# Altium schematic sheet Cameras.SchDoc
size Letter
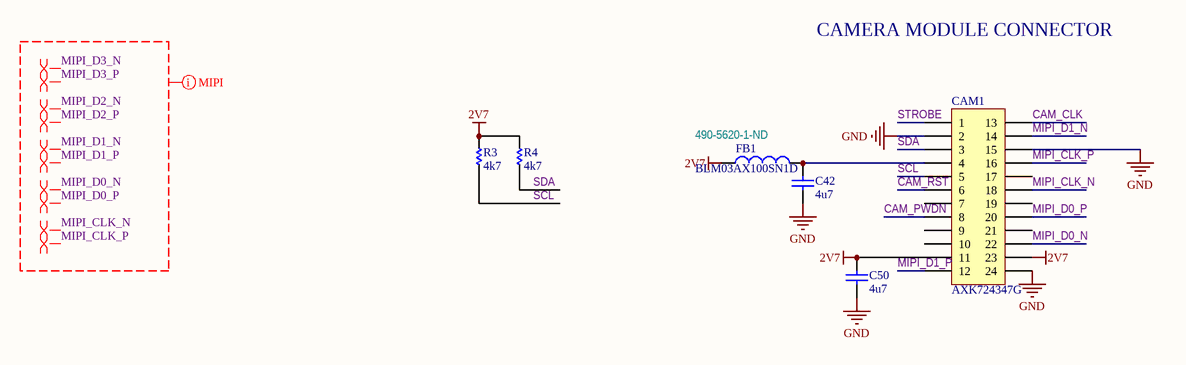
[diagram p0: Cameras.SchDoc]

## Parts
C42  4u7  [CAPC1005N]
C50  4u7  [CAPC1005N]
CAM1  AXK724347G  [LI-OV5640-MIPI-AF]
FB1  BLM03AX100SN1D  Supplier Part Number 1: 490-5620-1-ND  [1608[0603]]
R3  4k7  [RESC0603N]
R4  4k7  [RESC0603N]

## Nets
2V7: C50.2 CAM1.11 CAM1.23 FB1.1 R3.2 R4.2
GND: C42.1 C50.1 CAM1.2 CAM1.15 CAM1.24
CAM_CLK: CAM1.13
CAM_PWDN: CAM1.8
CAM_RST: CAM1.6
MIPI_CLK_N: CAM1.18
MIPI_CLK_P: CAM1.16
MIPI_D0_N: CAM1.22
MIPI_D0_P: CAM1.20
MIPI_D1_N: CAM1.14
MIPI_D1_P: CAM1.12
SCL: CAM1.5 R3.1
SDA: CAM1.3 R4.1
STROBE: CAM1.1
NetC42_2: C42.2 CAM1.4 FB1.2

Not connected (* = marked no-connect by the designer): CAM1 7 9 10 17 19 21

## Layout directives
net class MIPI2: MIPI_CLK_N, MIPI_CLK_P, MIPI_D0_N, MIPI_D0_P, MIPI_D1_N, MIPI_D1_P, MIPI_D2_N, MIPI_D2_P, MIPI_D3_N, MIPI_D3_P
differential pair: MIPI_CLK_N, MIPI_CLK_P, MIPI_D0_N, MIPI_D0_P, MIPI_D1_N, MIPI_D1_P, MIPI_D2_N, MIPI_D2_P, MIPI_D3_N, MIPI_D3_P

## Notes on the sheet
- CAMERA MODULE CONNECTOR
- Labels drawn without touching a wire or pin: MIPI_CLK_N, MIPI_CLK_P, MIPI_D0_N, MIPI_D0_P, MIPI_D1_N, MIPI_D1_P, MIPI_D2_N, MIPI_D2_P, MIPI_D3_N, MIPI_D3_P

## Library data of the parts
C42 C50 = Cap Semi: Capacitor (Semiconductor SIM Model); Published: 8-Jun-2000; LatestRevisionDate: 29-May-2009; LatestRevisionNote: IPC-7351 Footprint Added.; PackageReference: C1206; Publisher: Altium Limited; PackageDescription: Chip Capacitor
  C42: Supplier 1: Digi-Key; Supplier Part Number 1: 490-14306-1-ND
CAM1 = Header 12X2A: Header, 12-Pin, Dual row; LatestRevisionDate: 17-Jul-2002; LatestRevisionNote: Re-released for DXP Platform.; Publisher: Altium Limited
FB1 = Inductor: Code_IEC: 1005; Value: 10mH; Published: 8-Jun-2000; LatestRevisionDate: 29-May-2009; LatestRevisionNote: IPC-7351 Footprint Added.; PackageReference: 0402-A; Publisher: Altium Limited; PackageDescription: Chip Inductor; Code_JEITA: 0402; Supplier 1: Digi-Key
R3 R4 = Res Semi: Semiconductor Resistor; Published: 8-Jun-2000; LatestRevisionDate: 17-Jul-2002; LatestRevisionNote: Re-released for DXP Platform.; PackageReference: AXIAL-0.5; Publisher: Altium Limited; PackageDescription: Axial Device, Thru-Hole; 2 Leads; 0.5 in Pin Spacing